# Altium schematic sheet Boris_IO_4.SchDoc: Boris IO
size A4; Date: 2017.12.10; DrawnBy: Miklós Árpád; Revision: 1.0; SheetNumber: 4; SheetTotal: 5; PageSetup: Record=PageOptions|CenterHorizontal=True|CenterVertical=True|PrintScale=1.00|XCorrection=1.00|YCorrection=1.00|PrintKind=0|BorderSize=5000000|LeftOffset=0|BottomOffset=0|Orientation=2|PaperLength=1000|PaperWidth=1000|Scale=100|PaperSource=7|PrintQuality=-4|MediaType=1|DitherType=10|PaperKind=A4|PrintScaleMode=0
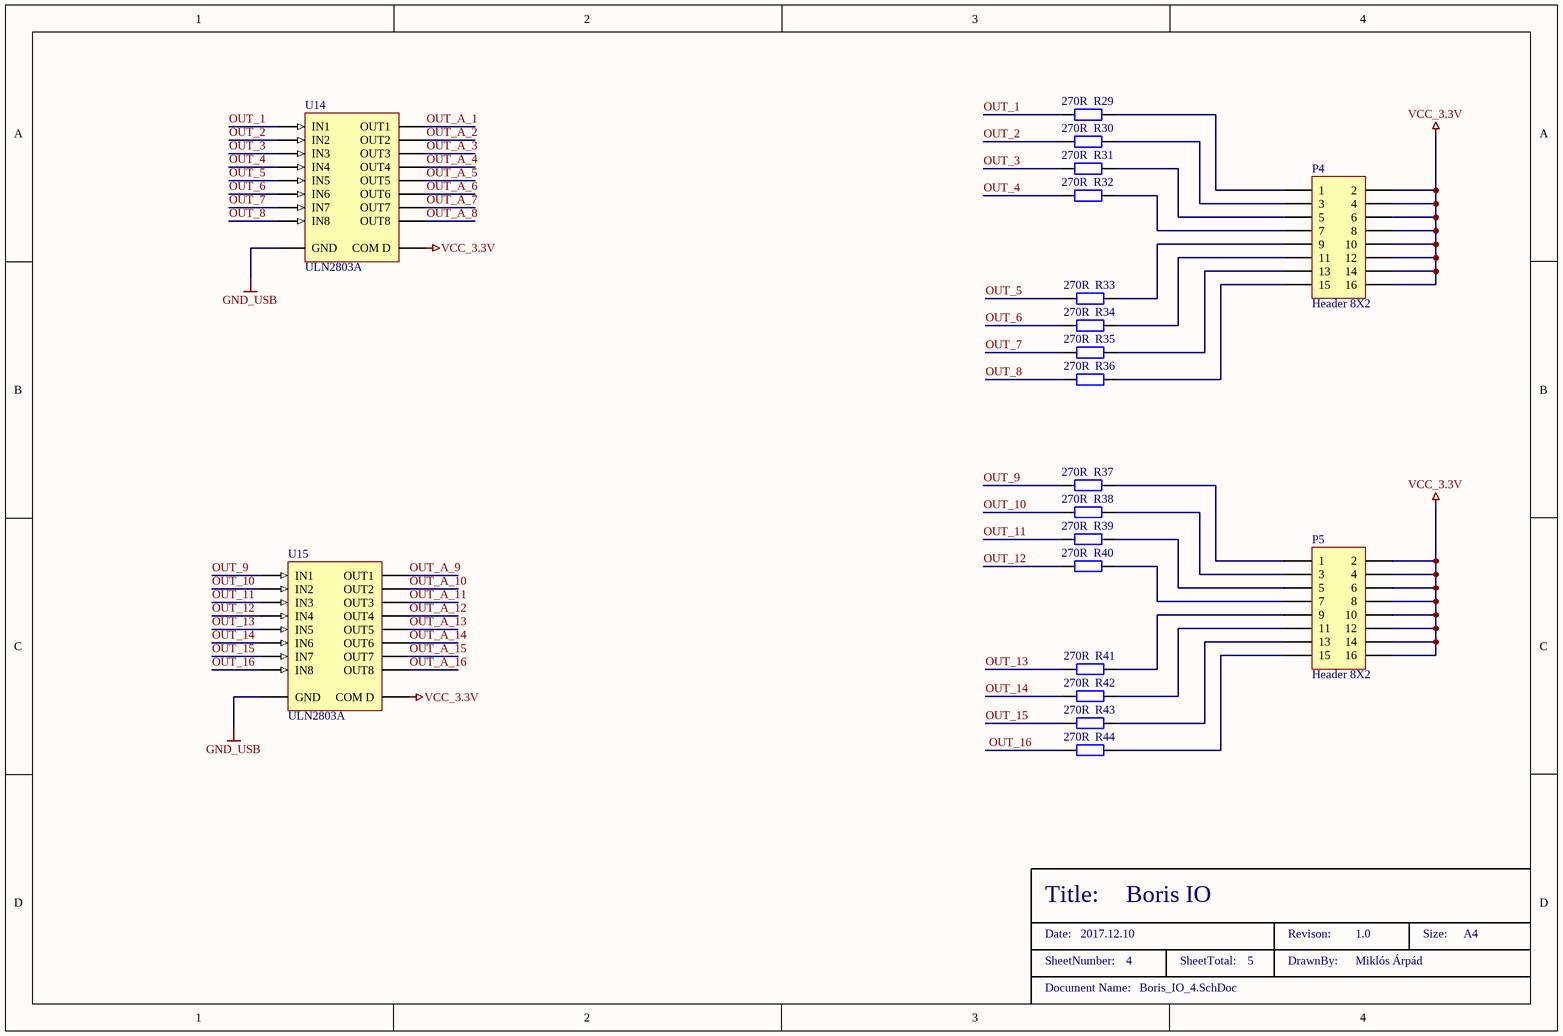
[diagram p0: Boris_IO_4.SchDoc]

## Parts
P4  Header 8X2  [HDR2X8]
P5  Header 8X2  [HDR2X8]
R29  270R  [0805_RES]
R30  270R  [0805_RES]
R31  270R  [0805_RES]
R32  270R  [0805_RES]
R33  270R  [0805_RES]
R34  270R  [0805_RES]
R35  270R  [0805_RES]
R36  270R  [0805_RES]
R37  270R  [0805_RES]
R38  270R  [0805_RES]
R39  270R  [0805_RES]
R40  270R  [0805_RES]
R41  270R  [0805_RES]
R42  270R  [0805_RES]
R43  270R  [0805_RES]
R44  270R  [0805_RES]
U14  ULN2803A  [DIP18]
U15  ULN2803A  [DIP18]

## Nets
GND_USB: U14.9(GND) U15.9(GND)
VCC_3.3V: P4.2 P4.4 P4.6 P4.8 P4.10 P4.12 P4.14 P4.16 P5.2 P5.4 P5.6 P5.8 P5.10 P5.12 P5.14 P5.16 U14.10(COM_D) U15.10(COM_D)
OUT_1: R29.1 U14.1(IN1)
OUT_2: R30.1 U14.2(IN2)
OUT_3: R31.1 U14.3(IN3)
OUT_4: R32.1 U14.4(IN4)
OUT_5: R33.1 U14.5(IN5)
OUT_6: R34.1 U14.6(IN6)
OUT_7: R35.1 U14.7(IN7)
OUT_8: R36.1 U14.8(IN8)
OUT_9: R37.1 U15.1(IN1)
OUT_10: R38.1 U15.2(IN2)
OUT_11: R39.1 U15.3(IN3)
OUT_12: R40.1 U15.4(IN4)
OUT_13: R41.1 U15.5(IN5)
OUT_14: R42.1 U15.6(IN6)
OUT_15: R43.1 U15.7(IN7)
OUT_16: R44.1 U15.8(IN8)
OUT_A_1: U14.18(OUT1)
OUT_A_2: U14.17(OUT2)
OUT_A_3: U14.16(OUT3)
OUT_A_4: U14.15(OUT4)
OUT_A_5: U14.14(OUT5)
OUT_A_6: U14.13(OUT6)
OUT_A_7: U14.12(OUT7)
OUT_A_8: U14.11(OUT8)
OUT_A_9: U15.18(OUT1)
OUT_A_10: U15.17(OUT2)
OUT_A_11: U15.16(OUT3)
OUT_A_12: U15.15(OUT4)
OUT_A_13: U15.14(OUT5)
OUT_A_14: U15.13(OUT6)
OUT_A_15: U15.12(OUT7)
OUT_A_16: U15.11(OUT8)
NetP4_1: P4.1 R29.2
NetP4_3: P4.3 R30.2
NetP4_5: P4.5 R31.2
NetP4_7: P4.7 R32.2
NetP4_9: P4.9 R33.2
NetP4_11: P4.11 R34.2
NetP4_13: P4.13 R35.2
NetP4_15: P4.15 R36.2
NetP5_1: P5.1 R37.2
NetP5_3: P5.3 R38.2
NetP5_5: P5.5 R39.2
NetP5_7: P5.7 R40.2
NetP5_9: P5.9 R41.2
NetP5_11: P5.11 R42.2
NetP5_13: P5.13 R43.2
NetP5_15: P5.15 R44.2

## Notes on the sheet
- Title:
- Date:
- SheetNumber:
- Document Name:
- SheetTotal:
- Revison:
- DrawnBy:
- Size:
- A4

## Library data of the parts
P4 P5 = Header 8X2: Header, 8-Pin, Dual row; LatestRevisionDate: 17-Jul-2002; LatestRevisionNote: Re-released for DXP Platform.; Publisher: Altium Limited
R29-R44 = Res2: Resistor; Value: 270R; Catalog Number: 92-00-31; Distributor: RET; Name: 270R
U14 U15 = ULN2803A: Eight Darlington Array; Published: 8-Jun-2000; LatestRevisionDate: 06-Jun-2005; LatestRevisionNote: Stylized 3D Model Added.; DatasheetVersion: Sep-1997; PackageReference: DIP18; Publisher: Altium Limited; PackageDescription: DIP; 18 Leads; Row Spacing 7.62 mm; Pitch 2.54 mm; ComponentLink1Description: Manufacturer Link; ComponentLink1URL: http://www.st.com/; ComponentLink2Description: Datasheet; ComponentLink2URL: http://www.st.com/stonline/products/literature/ds/1536/uln2801a.pdf